# EAGLE schematic QueenSchematics (EAGLE 9.7.0)
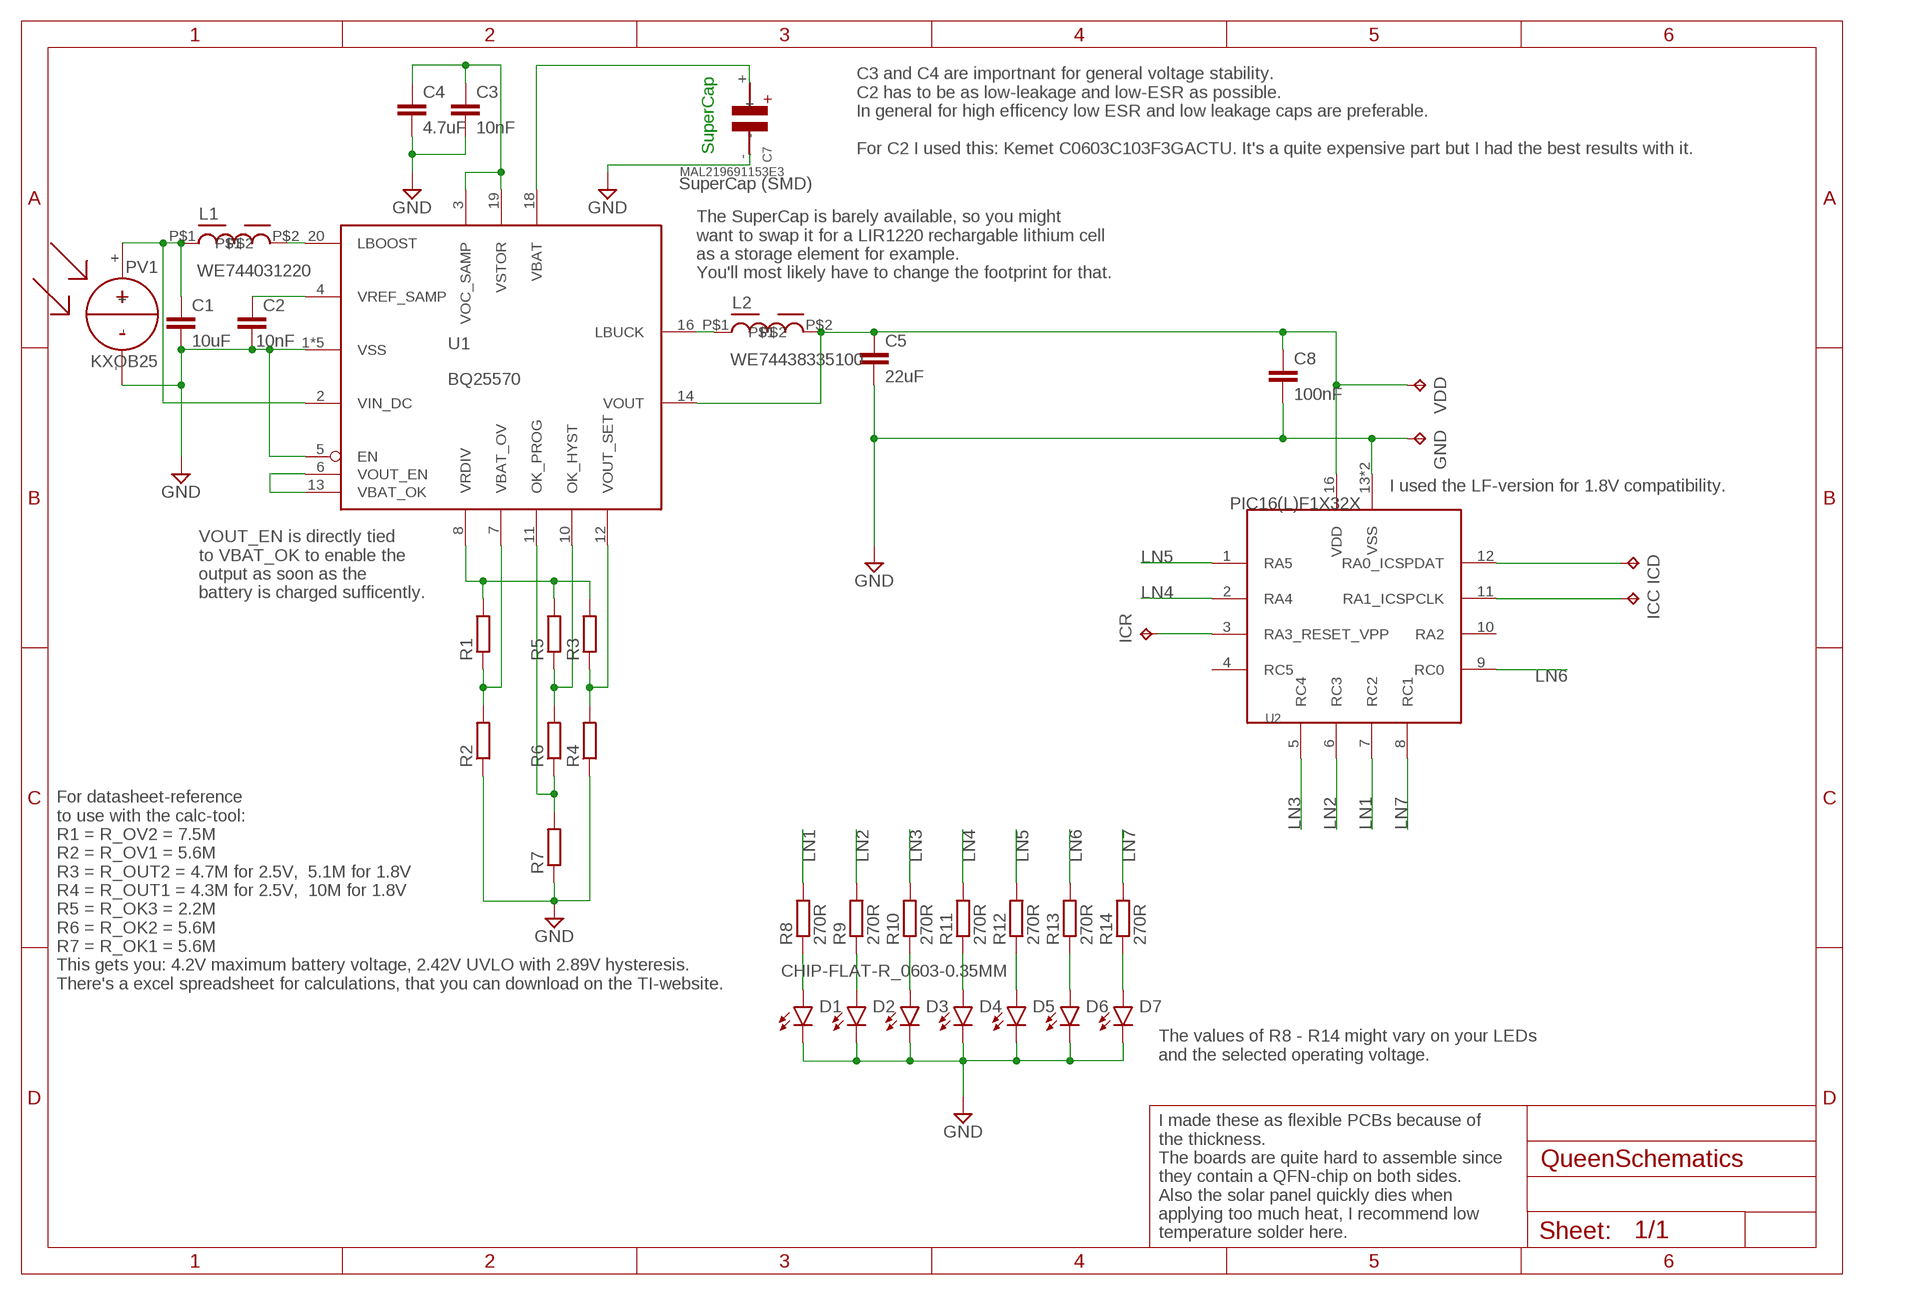
[diagram p0: schematic, sheet 1]

## Parts
C1  10uF  C-EUC0603K  [C0603K]
C2  10nF  C-EUC0603K  [C0603K]
C3  10nF  C-EUC0603K  [C0603K]
C4  4.7uF  C-EUC0603K  [C0603K]
C5  22uF  C-EUC0603K  [C0603K]
C7  MAL219691153E3  MAL21969115MAL219691153E2  [MAL219691153E2]
C8  100nF  C-EUC0603K  [C0603K]
D1  CHIP-FLAT-R_0603-0.35MM  [LEDC1608X35N]
D2  CHIP-FLAT-R_0603-0.35MM  [LEDC1608X35N]
D3  CHIP-FLAT-R_0603-0.35MM  [LEDC1608X35N]
D4  CHIP-FLAT-R_0603-0.35MM  [LEDC1608X35N]
D5  CHIP-FLAT-R_0603-0.35MM  [LEDC1608X35N]
D6  CHIP-FLAT-R_0603-0.35MM  [LEDC1608X35N]
D7  CHIP-FLAT-R_0603-0.35MM  [LEDC1608X35N]
GND  TPTP06SQ  [TP06SQ]
ICC  TPTP06SQ  [TP06SQ]
ICD  TPTP06SQ  [TP06SQ]
ICR  TPTP06SQ  [TP06SQ]
L1  WE744031220  [WE744031220]
L2  WE74438335100  [WE74438335100]
PV1  KXOB25  [KXOB25]
R1  R-EU_R0603  [R0603]
R2  R-EU_R0603  [R0603]
R3  R-EU_R0603  [R0603]
R4  R-EU_R0603  [R0603]
R5  R-EU_R0603  [R0603]
R6  R-EU_R0603  [R0603]
R7  R-EU_R0603  [R0603]
R8  270R  R-EU_R0603  [R0603]
R9  270R  R-EU_R0603  [R0603]
R10  270R  R-EU_R0603  [R0603]
R11  270R  R-EU_R0603  [R0603]
R12  270R  R-EU_R0603  [R0603]
R13  270R  R-EU_R0603  [R0603]
R14  270R  R-EU_R0603  [R0603]
U1  BQ25570  [QFN50P350X350X90-21T205N]
U2  PIC16(L)F1X32X  [QFN65P400X400X50-17T260N]
VDD  TPTP06SQ  [TP06SQ]

## Nets
GND: C1.2 C2.2 C3.2 C4.2 C5.2 C7.- C8.2 D1.C D2.C D3.C D4.C D5.C D6.C D7.C GND.TP PV1.- R2.1 R4.1 R7.1 U1.1(VSS) U1.5(EN) U1.9(VSS) U1.15(VSS) U1.17(VSS) U1.21(VSS) U2.13(VSS) U2.17(VSS)
LN1: R8.2 U2.7(RC2)
LN2: R9.2 U2.6(RC3)
LN3: R10.2 U2.5(RC4)
LN4: R11.2 U2.2(RA4)
LN5: R12.2 U2.1(RA5)
LN6: R13.2 U2.9(RC0)
LN7: R14.2 U2.8(RC1)
N$1: L1.P$2 U1.20(LBOOST)
N$2: C1.1 L1.P$1 PV1.+ U1.2(VIN_DC)
N$3: C2.1 U1.4(VREF_SAMP)
N$4: L2.P$1 U1.16(LBUCK)
N$5: C3.1 C4.1 U1.3(VOC_SAMP) U1.19(VSTOR)
N$6: U1.6(VOUT_EN) U1.13(VBAT_OK)
N$7: C5.1 C8.1 L2.P$2 U1.14(VOUT) U2.16(VDD) VDD.TP
N$8: C7.+ U1.18(VBAT)
N$10: R1.1 R2.2 U1.7(VBAT_OV)
N$11: R5.1 R6.2 U1.10(OK_HYST)
N$12: R3.1 R4.2 U1.12(VOUT_SET)
N$13: R6.1 R7.2 U1.11(OK_PROG)
N$14: ICR.TP U2.3(RA3_RESET_VPP)
N$15: ICD.TP U2.12(RA0_ICSPDAT)
N$16: ICC.TP U2.11(RA1_ICSPCLK)
N$17: D1.A R8.1
N$18: D2.A R9.1
N$19: D3.A R10.1
N$20: D4.A R11.1
N$21: D5.A R12.1
N$22: D6.A R13.1
N$23: D7.A R14.1
VRDRV: R1.2 R3.2 R5.2 U1.8(VRDIV)
Unconnected: U2.4(RC5) U2.10(RA2)

## Notes on the sheet
- SuperCap
- C3 and C4 are importnant for general voltage stability.
  C2 has to be as low-leakage and low-ESR as possible.
  In general for high efficency low ESR and low leakage caps are preferable.
  
  For C2 I used this: Kemet C0603C103F3GACTU. It's a quite expensive part but I had the best results with it.
- SuperCap (SMD)
- The SuperCap is barely available, so you might 
  want to swap it for a LIR1220 rechargable lithium cell 
  as a storage element for example. 
  You'll most likely have to change the footprint for that.
- I used the LF-version for 1.8V compatibility.
- VOUT_EN is directly tied 
  to VBAT_OK to enable the
  output as soon as the 
  battery is charged sufficently.
- For datasheet-reference
  to use with the calc-tool:
  R1 = R_OV2 = 7.5M
  R2 = R_OV1 = 5.6M
  R3 = R_OUT2 = 4.7M for 2.5V,  5.1M for 1.8V
  R4 = R_OUT1 = 4.3M for 2.5V,  10M for 1.8V
  R5 = R_OK3 = 2.2M
  R6 = R_OK2 = 5.6M
  R7 = R_OK1 = 5.6M
  This gets you: 4.2V maximum battery voltage, 2.42V UVLO with 2.89V hysteresis.
  There's a excel spreadsheet for calculations, that you can download on the TI-website.
- The values of R8 - R14 might vary on your LEDs 
  and the selected operating voltage.
- I made these as flexible PCBs because of 
  the thickness.
  The boards are quite hard to assemble since 
  they contain a QFN-chip on both sides.
  Also the solar panel quickly dies when 
  applying too much heat, I recommend low 
  temperature solder here.

## Library data of the parts
C1-C5 C8 = rcl:C-EU: CAPACITOR, European symbol; SPICEPREFIX: C
C7 = BQ25570:MAL21969115
D1-D7 = LED:CHIP-FLAT-R; CATEGORY: LED; COLOR: RED; DESCRIPTION: CHIP LED FLAT; SUB-CATEGORY: CHIP; TYPE: FLAT_TOP
GND ICC ICD ICR VDD = testpad:TP: Test pad
L1 = BQ25570:WE744031220
L2 = BQ25570:WE74438335100
PV1 = BQ25570:KXOB25
R1-R14 = rcl:R-EU_: RESISTOR, European symbol; SPICEPREFIX: R
U1 = BQ25570:BQ25570
U2 = BQ25570:PIC16(L)F1X32X